# Altium project SmartLink.PrjPcb
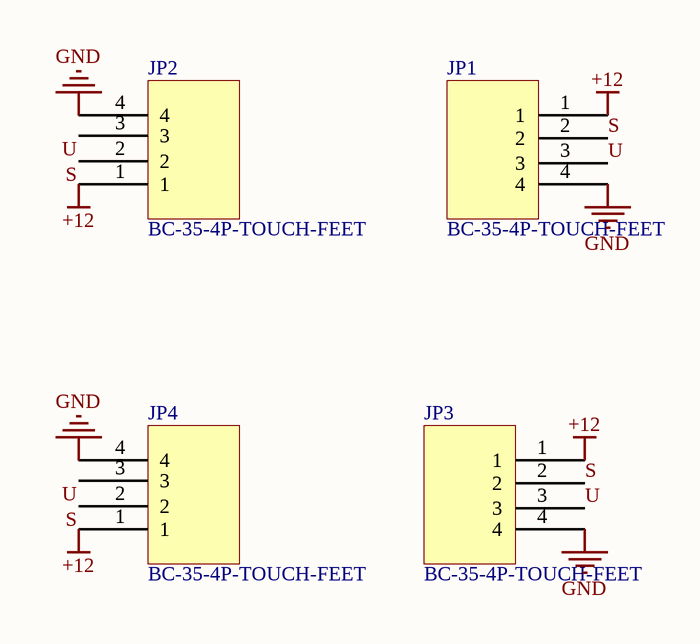
[diagram p0: SmartLink.SchDoc]
1 sheet, 4 parts. Net scope: global (net labels, ports and power ports of the same name join across sheets).
Board file: SmartLink.PcbDoc

## Sheet SmartLink.SchDoc
size A4

### Parts
JP1  BC-35-4P-TOUCH-FEET  [BC-35-4P-TOUCH-FEET]
JP2  BC-35-4P-TOUCH-FEET  [BC-35-4P-TOUCH-FEET]
JP3  BC-35-4P-TOUCH-FEET  [BC-35-4P-TOUCH-FEET]
JP4  BC-35-4P-TOUCH-FEET  [BC-35-4P-TOUCH-FEET]

### Nets
+12: JP1.1 JP2.1 JP3.1 JP4.1
GND: JP1.4 JP2.4 JP3.4 JP4.4
S: JP1.2 JP2.2 JP3.2 JP4.2
U: JP1.3 JP2.3 JP3.3 JP4.3